# Altium schematic sheet MODULIQ_CFD.SchDoc: 4ch CFD
size A3; Author: M.Beldyga; CompanyName: WUT ISE; DrawnBy: M.Beldyga; Organization: WUT ISE; Address1: PW ISE; Address2: Nowowiejska 15/19 00-665 Warsaw; Address3: micbeldyga@gmail.com; SheetNumber: 1; SheetTotal: 3; ModifiedBy: -; CheckedDate: -; Title2: MODULIQ; DivGrp: WUT ISE; Designer: M.Beldyga; ModifiedDate: -; ProjectName: Sensor Box
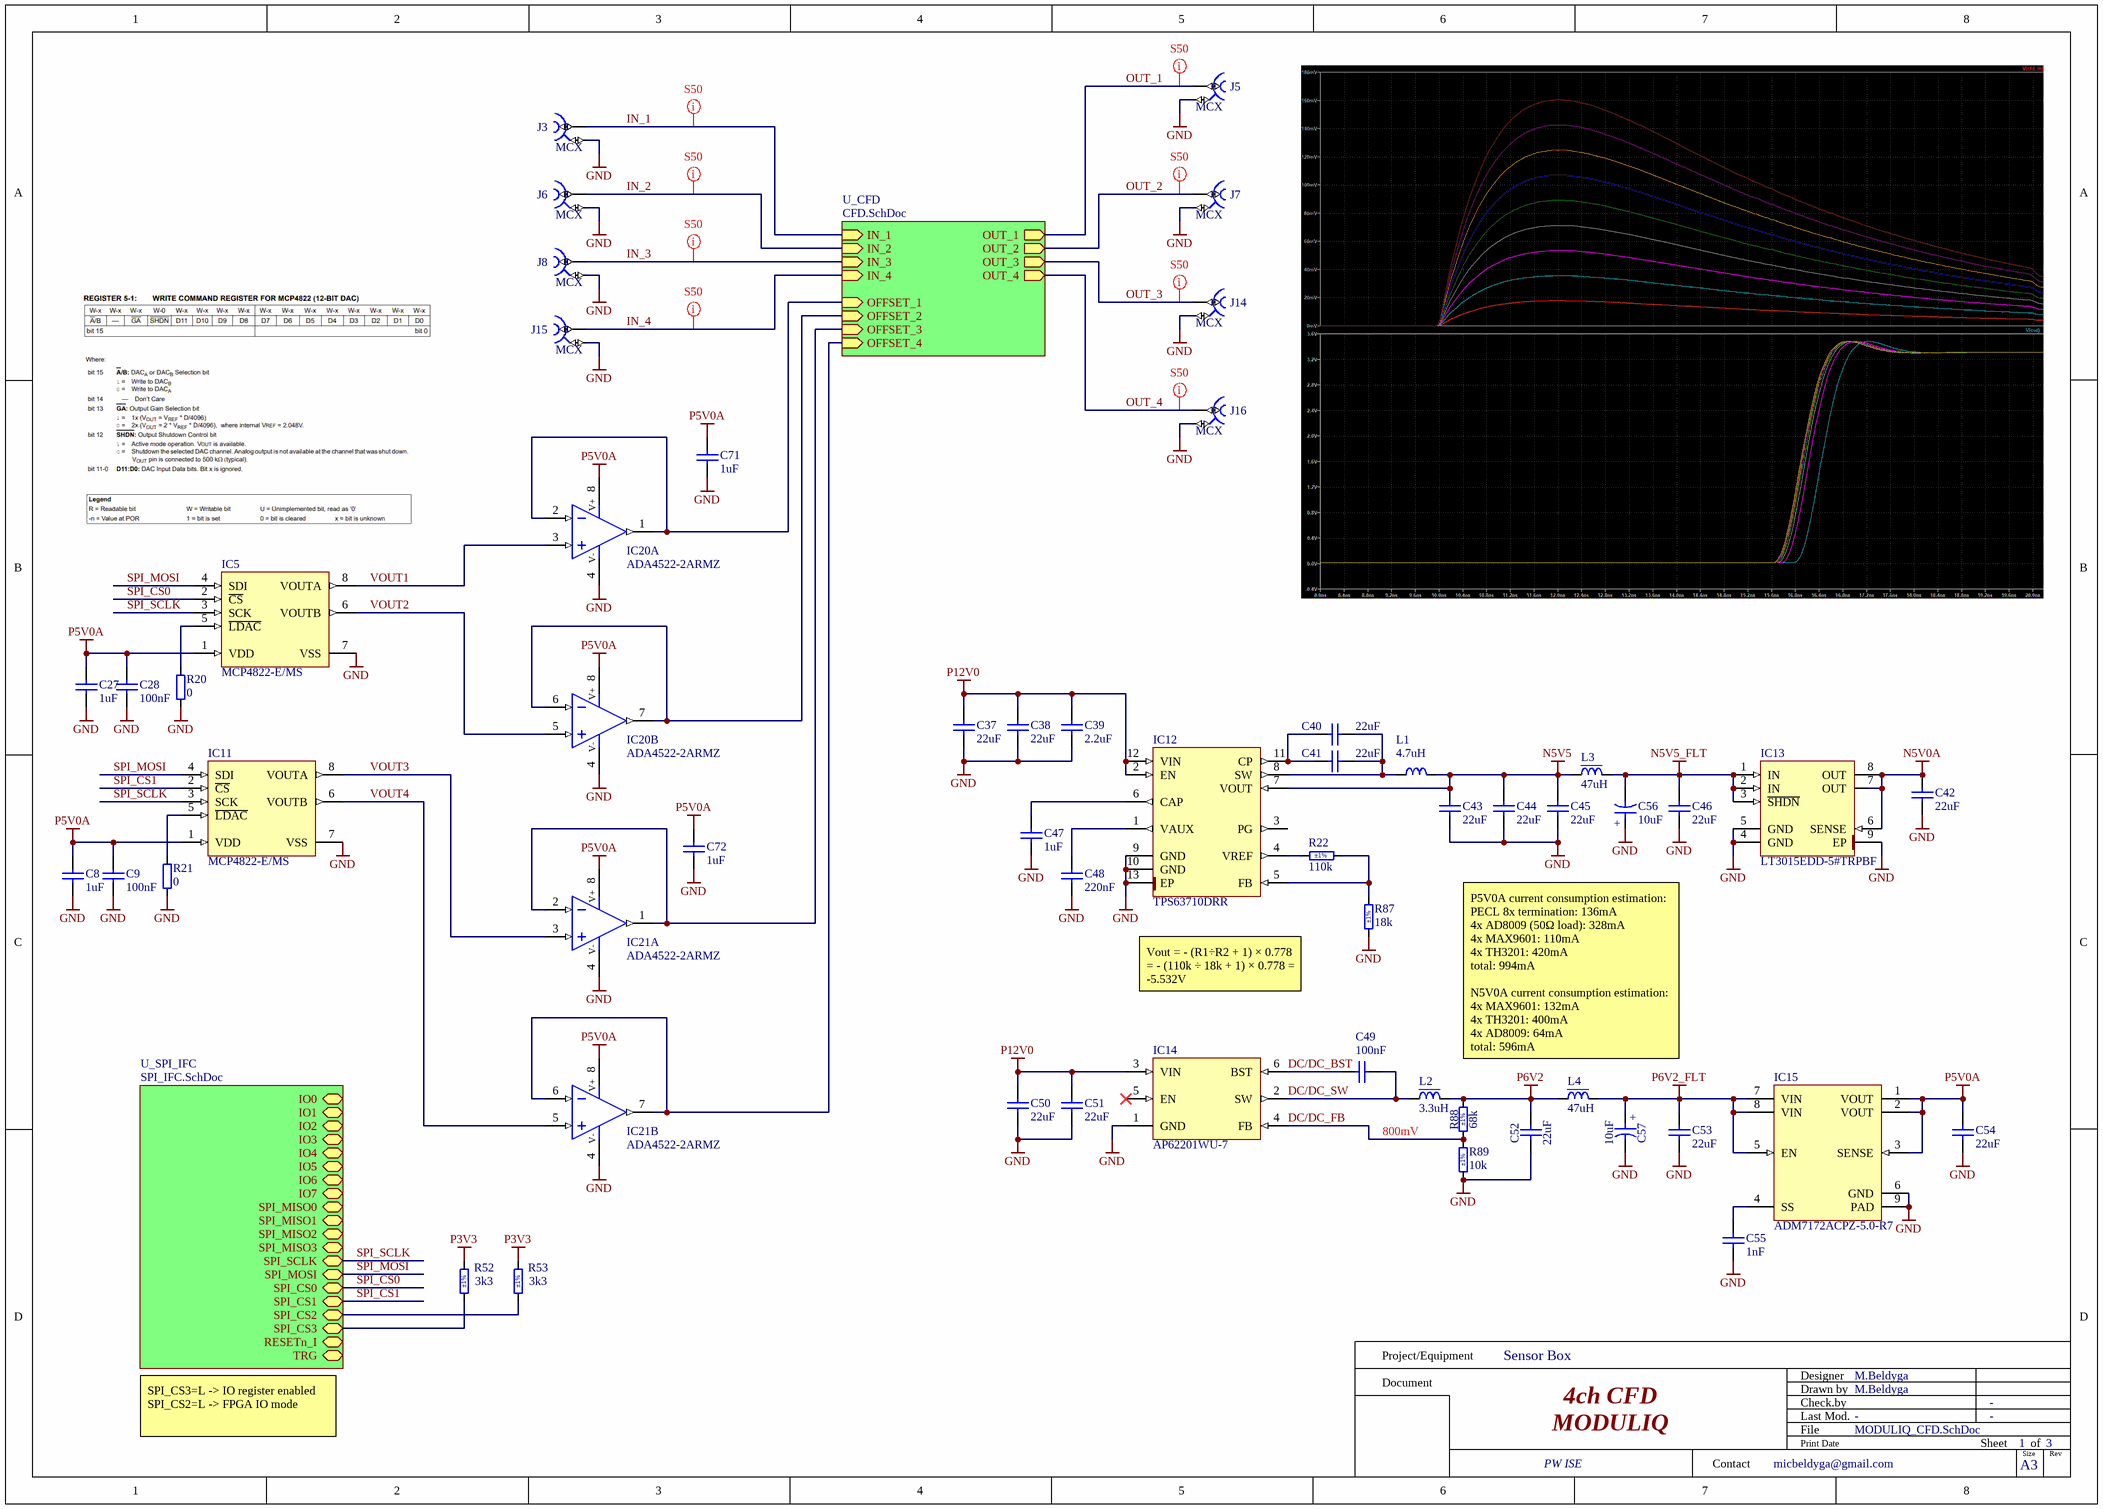
[diagram p0: MODULIQ_CFD.SchDoc]

## Parts
C8  1uF  [CAPC1005X55N]
C9  100nF  [CAPC1005X55N]
C27  1uF  [CAPC1005X55N]
C28  100nF  [CAPC1005X55N]
C37  22uF  [CAPC2012X135N]
C38  22uF  [CAPC2012X135N]
C39  2.2uF  [CAPC1005X55N]
C40  22uF  [CAPC2012X135N]
C41  22uF  [CAPC2012X135N]
C42  22uF  [CAPC2012X135N]
C43  22uF  [CAPC2012X135N]
C44  22uF  [CAPC2012X135N]
C45  22uF  [CAPC2012X135N]
C46  22uF  [CAPC2012X135N]
C47  1uF  [CAPC1005X55N]
C48  220nF  [CAPC1005X55N]
C49  100nF  [CAPC1005X55N]
C50  22uF  [CAPC2012X135N]
C51  22uF  [CAPC2012X135N]
C52  22uF  [CAPC2012X135N]
C53  22uF  [CAPC2012X135N]
C54  22uF  [CAPC2012X135N]
C55  1nF  [CAPC1005X55N]
C56  10uF  [CAPMP3216X180N]
C57  10uF  [CAPMP3216X180N]
C71  1uF  [CAPC1005X55N]
C72  1uF  [CAPC1005X55N]
IC5  MCP4822-E/MS  [SOP65P490X110-8N]
IC11  MCP4822-E/MS  [SOP65P490X110-8N]
IC12  TPS63710DRR  [SON50P300X300X80-13N-R160X260]
IC13  LT3015EDD-5#TRPBF  [SON50P300X300X80-9N-R175X248]
IC14  AP62201WU-7  [SOT95P280X100-6N]
IC15  ADM7172ACPZ-5.0-R7  [SON50P300X80_HS-9N]
IC20  ADA4522-2ARMZ  [SOP65P490X110-8N]  (parts A,B of 2)
IC21  ADA4522-2ARMZ  [SOP65P490X110-8N]  (parts A,B of 2)
J3  MCX  [AMPHENOL_919-109J-51PX]
J5  MCX  [AMPHENOL_919-109J-51PX]
J6  MCX  [AMPHENOL_919-109J-51PX]
J7  MCX  [AMPHENOL_919-109J-51PX]
J8  MCX  [AMPHENOL_919-109J-51PX]
J14  MCX  [AMPHENOL_919-109J-51PX]
J15  MCX  [AMPHENOL_919-109J-51PX]
J16  MCX  [AMPHENOL_919-109J-51PX]
L1  4.7uH  [IND_COILCRAFT_EPL3015]
L2  3.3uH  [IND_COILCRAFT_SD43]
L3  47uH  [IND_WURTH_WE-LHMI_7050]
L4  47uH  [IND_WURTH_WE-LHMI_7050]
R20  0  [RESC1005X40N]
R21  0  [RESC1005X40N]
R22  110k  Tolerance: ±1%  [RESC1005X40N]
R52  3k3  Tolerance: ±1%  [RESC1005X40N]
R53  3k3  Tolerance: ±1%  [RESC1005X40N]
R87  18k  Tolerance: ±1%  [RESC1005X40N]
R88  68k  Tolerance: ±1%  [RESC1005X40N]
R89  10k  Tolerance: ±1%  [RESC1005X40N]

## Sub-sheets
U_CFD = CFD.SchDoc: OFFSET_1 (in), IN_1 (in), OUT_1 (out), IN_2 (in), IN_3 (in), IN_4 (in), OFFSET_2 (in), OFFSET_3 (in), OFFSET_4 (in), OUT_2 (out), OUT_3 (out), OUT_4 (out)
U_SPI_IFC = SPI_IFC.SchDoc: IO0 (bidir), IO1 (bidir), IO2 (bidir), IO3 (bidir), IO4 (bidir), IO5 (bidir), IO6 (bidir), IO7 (bidir), SPI_MISO0 (bidir), SPI_MISO1 (bidir), SPI_MISO2 (bidir), SPI_MISO3 (bidir), SPI_SCLK (bidir), SPI_MOSI (bidir), SPI_CS0 (bidir), SPI_CS1 (bidir), SPI_CS2 (bidir), SPI_CS3 (bidir), RESETn_I (bidir), TRG (bidir)

## Nets
GND: C8.1 C9.1 C27.1 C28.1 C37.1 C38.1 C39.1 C42.1 C43.1 C44.1 C45.1 C46.1 C47.1 C48.1 C50.1 C51.1 C52.1 C53.1 C54.1 C55.1 C56.1 C57.2 C71.1 C72.1 IC5.7(VSS) IC11.7(VSS) IC12.9(GND) IC12.10(GND) IC12.13(EP) IC13.4(GND) IC13.5(GND) IC13.9(EP) IC14.1(GND) IC15.6(GND) IC15.9(PAD) IC20.4(V-) IC21.4(V-) J3.2 J5.2 J6.2 J7.2 J8.2 J14.2 J15.2 J16.2 R20.1 R21.1 R87.1 R89.1
N5V0A: C42.2 IC13.6(SENSE) IC13.7(OUT) IC13.8(OUT)
N5V5: C43.2 C44.2 C45.2 IC12.7(VOUT) L1.2 L3.1
N5V5_FLT: C46.2 C56.2 IC13.1(IN) IC13.2(IN) IC13.3(~{SHDN}) L3.2
P3V3: R52.1 R53.1
P5V0A: C8.2 C9.2 C27.2 C28.2 C54.2 C71.2 C72.2 IC5.1(VDD) IC11.1(VDD) IC15.1(VOUT) IC15.2(VOUT) IC15.3(SENSE) IC20.8(V+) IC21.8(V+)
P6V2: C52.2 L2.2 L4.1 R88.2
P6V2_FLT: C53.2 C57.1 IC15.5(EN) IC15.7(VIN) IC15.8(VIN) L4.2
P12V0: C37.2 C38.2 C39.2 C50.2 C51.2 IC12.2(EN) IC12.12(VIN) IC14.3(VIN)
DC/DC_BST: C49.1 IC14.6(BST)
DC/DC_FB: IC14.4(FB) R88.1 R89.2
DC/DC_SW: C49.2 IC14.2(SW) L2.1
IN_1: J3.1 ; sheet U_CFD/IN_1
IN_2: J6.1 ; sheet U_CFD/IN_2
IN_3: J8.1 ; sheet U_CFD/IN_3
IN_4: J15.1 ; sheet U_CFD/IN_4
OUT_1: J5.1 ; sheet U_CFD/OUT_1
OUT_2: J7.1 ; sheet U_CFD/OUT_2
OUT_3: J14.1 ; sheet U_CFD/OUT_3
OUT_4: J16.1 ; sheet U_CFD/OUT_4
SPI_CS0: IC5.2(~{CS}) ; sheet U_SPI_IFC/SPI_CS0
SPI_CS1: IC11.2(~{CS}) ; sheet U_SPI_IFC/SPI_CS1
SPI_MOSI: IC5.4(SDI) IC11.4(SDI) ; sheet U_SPI_IFC/SPI_MOSI
SPI_SCLK: IC5.3(SCK) IC11.3(SCK) ; sheet U_SPI_IFC/SPI_SCLK
VOUT1: IC5.8(VOUTA) IC20.3(IN+)
VOUT2: IC5.6(VOUTB) IC20.5(IN+)
VOUT3: IC11.8(VOUTA) IC21.3(IN+)
VOUT4: IC11.6(VOUTB) IC21.5(IN+)
NetC40_1: C40.1 C41.1 IC12.8(SW) L1.1
NetC40_2: C40.2 C41.2 IC12.11(CP)
NetC47_2: C47.2 IC12.6(CAP)
NetC48_2: C48.2 IC12.1(VAUX)
NetC55_2: C55.2 IC15.4(SS)
NetIC5_5: IC5.5(~{LDAC}) R20.2
NetIC11_5: IC11.5(~{LDAC}) R21.2
NetIC12_4: IC12.4(VREF) R22.1
NetIC12_5: IC12.5(FB) R22.2 R87.2
NetIC20_1: IC20.1(OUT) IC20.2(IN-) ; sheet U_CFD/OFFSET_1
NetIC20_6: IC20.6(IN-) IC20.7(OUT) ; sheet U_CFD/OFFSET_2
NetIC21_1: IC21.1(OUT) IC21.2(IN-) ; sheet U_CFD/OFFSET_3
NetIC21_6: IC21.6(IN-) IC21.7(OUT) ; sheet U_CFD/OFFSET_4
NetR52_2: R52.2 ; sheet U_SPI_IFC/SPI_CS3
NetR53_2: R53.2 ; sheet U_SPI_IFC/SPI_CS2

Not connected (* = marked no-connect by the designer): IC12 3(PG); IC14 5(EN)*

## Layout directives
net class S50: IN_1, IN_2, IN_3, IN_4, OUT_1, OUT_2, OUT_3, OUT_4

## Notes on the sheet
- Vout = - (R1÷R2 + 1) × 0.778 = - (110k ÷ 18k + 1) × 0.778 = -5.532V
- P5V0A current consumption estimation:
  PECL 8x termination: 136mA
  4x AD8009 (50Ω load): 328mA
  4x MAX9601: 110mA
  4x TH3201: 420mA
  total: 994mA
  N5V0A current consumption estimation:
  4x MAX9601: 132mA
  4x TH3201: 400mA
  4x AD8009: 64mA
  total: 596mA
- (near L2) 800mV
- SPI_CS3=L -> IO register enabled
  SPI_CS2=L -> FPGA IO mode
- Project/Equipment
- Document
- Designer
- Drawn by
- Check.by
- Contact
- File
- Last Mod.
- Print Date
- Sheet
- Size
- A3
- of
- Rev
- (in symbol CTE3216-18_10UF_16V_20%_AVX_TCJ) +

## Library data of the parts
C8 C27 C47 C71 C72 = CC0402_1UF_16V_10%_X5R: Non-polarised capacitor; Part Description: SMD Multilayer Chip Ceramic Capacitor; Manufacturer: GENERIC; Manufacturer1 Part Number: C1005X5R1C105KT; Voltage: 16V; TC: X5R; Tolerance: ±10%; Part Number: CC0402_1UF_16V_10%_X5R; Component Kind: Standard; Component Type: Standard; Pin Count: 2; Value: 1uF; Status: Preferred; Manufacturer Part Number: CC0402_1UF_16V_10%_X5R; Case: 0402; Mounted: Yes; Socket: No; SMD: Yes; Sense: No; Manufacturer1 Example: TDK; Manufacturer1 ComponentHeight: 0.55mm; HelpURL: \\cern.ch\dfs\Applications\Altium\Datasheets\CC0402_X5R_TDK_C.pdf; Author: CERN DEM JLC; CreateDate: 10/25/2012; LatestRevisionDate: 10/25/2012
C9 C28 = CC0402_100NF_50V_10%_X7R: Non-polarised capacitor; Part Description: SMD Multilayer Chip Ceramic Capacitor; Manufacturer: GENERIC; Manufacturer1 Part Number: GRM155R71H104KE14D; Voltage: 50V; TC: X7R; Tolerance: ±10%; Part Number: CC0402_100NF_50V_10%_X7R; Component Kind: Standard; Component Type: Standard; Pin Count: 2; Value: 100nF; Status: None; Manufacturer Part Number: CC0402_100NF_50V_10%_X7R; Case: 0402; Mounted: Yes; Socket: No; SMD: Yes; Sense: No; Manufacturer1 Example: MURATA; Manufacturer1 ComponentHeight: 0.55mm; HelpURL: \\cern.ch\dfs\Applications\Altium\Datasheets\CC0402_MURATA_GRM155R71H104KE14D.pdf; Author: CERN DEM MR; CreateDate: 6/30/2017; LatestRevisionDate: 6/30/2017
C37 C38 C40-C46 C50-C54 = CC0805_22UF_16V_10%_X5R: Non-polarised capacitor; Part Description: SMD Multilayer Chip Ceramic Capacitor; Manufacturer: GENERIC; Manufacturer1 Part Number: C2012X5R1C226KT; Voltage: 16V; TC: X5R; Tolerance: ±10%; Part Number: CC0805_22UF_16V_10%_X5R; Component Kind: Standard; Component Type: Standard; Pin Count: 2; Value: 22uF; Status: Preferred; Manufacturer Part Number: CC0805_22UF_16V_10%_X5R; Case: 0805; Mounted: Yes; Socket: No; SMD: Yes; Sense: No; Manufacturer1 Example: TDK; Manufacturer1 ComponentHeight: 1.35mm; HelpURL: \\cern.ch\dfs\Applications\Altium\Datasheets\CC0805_X5R_TDK_C.pdf; Author: CERN DEM JLC
  C37 C38 C40-C46 C50 C51 C53 C54: CreateDate: 10/25/2012; LatestRevisionDate: 10/25/2012
  C52: CreateDate: 25.10.2012; LatestRevisionDate: 25.10.2012
C39 = CC0402_2.2UF_25V_10%_X5R: Non-polarised capacitor; Part Description: SMD Multilayer Chip Ceramic Capacitor; Manufacturer: GENERIC; Manufacturer1 Part Number: C1005X5R1E225K050; Voltage: 25V; TC: X5R; Tolerance: ±10%; Part Number: CC0402_2.2UF_25V_10%_X5R; Component Kind: Standard; Component Type: Standard; Pin Count: 2; Value: 2.2uF; Status: None; Manufacturer Part Number: CC0402_2.2UF_25V_10%_X5R; Case: 0402; Mounted: Yes; Socket: No; SMD: Yes; Sense: No; Manufacturer1 Example: TDK; Manufacturer1 ComponentHeight: 0.65mm; HelpURL: \\cern.ch\dfs\Applications\Altium\Datasheets\CC0402_X5R_TDK_C.pdf; Author: CERN DEM BC; CreateDate: 1/10/2020; LatestRevisionDate: 1/10/2020
C48 = CC0402_220NF_25V_10%_X7R: Non-polarised capacitor; Part Description: SMD Multilayer Chip Ceramic Capacitor; Manufacturer: GENERIC; Manufacturer1 Part Number: C1005X7R1E224K050; Voltage: 25V; TC: X7R; Tolerance: ±10%; Part Number: CC0402_220NF_25V_10%_X7R; Component Kind: Standard; Component Type: Standard; Pin Count: 2; Value: 220nF; Status: Preferred; Manufacturer Part Number: CC0402_220NF_25V_10%_X7R; Case: 0402; Mounted: Yes; Socket: No; SMD: Yes; Sense: No; Manufacturer1 Example: TDK; Manufacturer1 ComponentHeight: 0.55mm; HelpURL: \\cern.ch\dfs\Applications\Altium\Datasheets\CC0402_X7R_TDK_C.pdf; Author: CERN DEM BC; CreateDate: 10/19/2020; LatestRevisionDate: 10/19/2020
C49 = CC0402_100NF_16V_10%_X7R: Non-polarised capacitor; Part Description: SMD Multilayer Chip Ceramic Capacitor; Manufacturer: GENERIC; Manufacturer1 Part Number: GRM155R71C104KA88D; Voltage: 16V; TC: X7R; Tolerance: ±10%; Part Number: CC0402_100NF_16V_10%_X7R; Component Kind: Standard; Component Type: Standard; Pin Count: 2; Value: 100nF; Status: Not Recommended; Manufacturer Part Number: CC0402_100NF_16V_10%_X7R; Case: 0402; Mounted: Yes; Socket: No; SMD: Yes; Sense: No; Manufacturer1 Example: MURATA; Manufacturer1 ComponentHeight: 0.55mm; HelpURL: \\cern.ch\dfs\Applications\Altium\Datasheets\CC0402_X7R_MURATA_GRM.pdf; Author: CERN DEM JLC; CreateDate: 12/5/2013; LatestRevisionDate: 12/3/2007
C55 = CC0402_1NF_50V_10%_X7R: Non-polarised capacitor; Part Description: SMD Multilayer Chip Ceramic Capacitor; Manufacturer: GENERIC; Manufacturer1 Part Number: 223858715623; Voltage: 50V; TC: X7R; Tolerance: ±10%; Part Number: CC0402_1NF_50V_10%_X7R; Component Kind: Standard; Component Type: Standard; Pin Count: 2; Value: 1nF; Status: Not Recommended; Manufacturer Part Number: CC0402_1NF_50V_10%_X7R; Case: 0402; Mounted: Yes; Socket: No; SMD: Yes; Sense: No; Manufacturer1 Example: PHYCOMP; Manufacturer1 ComponentHeight: 0.55mm; HelpURL: \\cern.ch\dfs\Applications\Altium\Datasheets\CC0402_X7R_PHYCOMP.pdf; Author: CERN DEM JLC; CreateDate: 12/3/2007; LatestRevisionDate: 12/3/2007
C56 C57 = CTE3216-18_10UF_16V_20%_AVX_TCJ: Polarised capacitor; Part Description: ESR 0R200 Tantalum Solid Electrolytic Chip Capacitor with Conductive Polymer Electrode; Manufacturer: AVX; Manufacturer Part Number: TCJA106M016R0200; Voltage: 16V; Tolerance: ±20%; Part Number: CTE3216-18_10UF_16V_20%_AVX_TCJ; Component Kind: Standard; Component Type: Standard; Pin Count: 2; Value: 10uF; Status: Preferred; Case: A; Mounted: Yes; Socket: No; SMD: Yes; Sense: No; ComponentHeight: 1.8mm; HelpURL: \\cern.ch\dfs\Applications\Altium\Datasheets\CTE_AVX_TCJ.pdf; Author: CERN DEM JLC; CreateDate: 29.03.2012; LatestRevisionDate: 29.03.2012
IC5 IC11 = MCP4822-E/MS: 12-Bit Dual Voltage Output Digital-to-Analog Converter with Internal VREF and SPI Interface; Manufacturer: MICROCHIP TECHNOLOGY; PressFit: No; Bonding: No; Part Number: MCP4822-E/MS; Component Kind: Standard; Component Type: Standard; Device: MCP4822-E/MS; PackageDescription: SOP, 0.65mm Pitch; 8 Pin, 3.00mm W X 3.00mm L X 1.10mm H body, IPC Medium Density; Part Description: 12-Bit Dual Voltage Output Digital-to-Analog Converter with Internal VREF and SPI Interface; Manufacturer Part Number: MCP4822-E/MS; Pin Count: 8; Case: MSOP8; Mounted: Yes; Socket: No; SMD: Yes; Sense: No; ComponentHeight: 1.1mm; Author: CERN DEM MR; HelpURL: \\cern.ch\dfs\Applications\Altium\Datasheets\MCP4822-E-MS.pdf; CreateDate: 3/16/2016; LatestRevisionDate: 3/16/2016
IC12 = TPS63710DRR: -1 to -5.5VDC, 1A Output, Low Noise Synchronous Inverting Buck Converter; Manufacturer: TEXAS INSTRUMENTS; PressFit: No; Bonding: No; Part Number: TPS63710DRR; Component Kind: Standard; Component Type: Standard; Device: TPS63710DRR; PackageDescription: SON, 0.50mm Pitch; 12 Pin, 3.00mm W X 3.00mm L X 0.80mm H body (w/Thermal Tab 1.60 X 2.60mm), IPC Medium Density; Part Description: -1 to -5.5VDC, 1A Output, Low Noise Synchronous Inverting Buck Converter; Manufacturer Part Number: TPS63710DRR; Pin Count: 13; Case: SON12; Mounted: Yes; Socket: No; SMD: Yes; Sense: No; ComponentHeight: 0.8mm; HelpURL: \\cern.ch\dfs\Applications\Altium\Datasheets\TPS63710DRR.pdf; Author: CERN DEM BC; CreateDate: 2/11/2019; LatestRevisionDate: 2/11/2019
IC13 = LT3015EDD-5#TRPBF: SP-LINREG -5V 1.5A, Low Noise, Negative Linear Regulator with Precision Current Limit; Manufacturer: Analog Devices; Manufacturer Lifecycle Status: PRODUCTION; Dropout Voltage: 310mV; Max Supply Voltage: -1.8V; Min Current Limit: 1.7A; Min Input Voltage: -30V; Number of Outputs: 1; Operating Supply Current: 1.1mA; Power Supply Rejection Ratio (PSRR): 58dB; Supplier: DigiKey; Supplier Part Number: LT3015EDD-5#TRPBFCT-ND; Manufacturer Part Number: LT3015EDD-5#TRPBF; RoHS: Compliant; Category: Voltage Regulators - Linear; Stock: 583; Pricing: 1=9.06, 10=6.116, 25=5.348, 100=4.4793, 250=4.05276, 500=4.0125 (USD); Case/Package: DFN; Lifecycle Status: Production; Max Operating Temperature: 125°C; Min Operating Temperature: -40°C; Pins: 8; Number of Regulators: 1; Output Current: 1.5A; Output Voltage: -5V; Packaging: Tape and Reel; ComponentLink1URL: https://datasheet.octopart.com:443/LT3015EDD-5%23TRPBF-Linear-Technology-datasheet-17020859.pdf?src-supplier=Upverter; ComponentLink1Description: https://datasheet.octopart.com:443/LT3015EDD-5%23TRPBF-Linear-Technology-datasheet-17020859.pdf?src-supplier=Upverter; ComponentLink2URL: https://datasheet.octopart.com:443/LT3015EDD-5%23TRPBF-Analog-Devices-datasheet-158590489.pdf?src-supplier=Augswan; ComponentLink2Description: https://datasheet.octopart.com:443/LT3015EDD-5%23TRPBF-Analog-Devices-datasheet-158590489.pdf?src-supplier=Augswan; ComponentLink3URL: https://datasheet.octopart.com:443/LT3015EDD-5%23TRPBF-Linear-Technology-datasheet-11545014.pdf?src-supplier=Arrow+Electronics; ComponentLink3Description: https://datasheet.octopart.com:443/LT3015EDD-5%23TRPBF-Linear-Technology-datasheet-11545014.pdf?src-supplier=Arrow+Electronics; ComponentLink4URL: https://datasheet.octopart.com:443/LT3015EDD-5%23TRPBF-Linear-Technology-datasheet-10541950.pdf?src-supplier=Component+Distributors+Inc.; ComponentLink4Description: https://datasheet.octopart.com:443/LT3015EDD-5%23TRPBF-Linear-Technology-datasheet-10541950.pdf?src-supplier=Component+Distributors+Inc.; ComponentLink5URL: https://sigma.octopart.com:443/57689710/technical_drawing/Linear-Technology-LT3015EDD-5%23TRPBF.pdf?src-supplier=Linear+Technology; ComponentLink5Description: https://sigma.octopart.com:443/57689710/technical_drawing/Linear-Technology-LT3015EDD-5%23TRPBF.pdf?src-supplier=Linear+Technology; ComponentLink6URL: http://sigma.octopart.com:80/conflict_mineral_statement/Analog-Devices-company-33.pdf?src-supplier=Compliance+Statements; ComponentLink6Description: http://sigma.octopart.com:80/conflict_mineral_statement/Analog-Devices-company-33.pdf?src-supplier=Compliance+Statements
IC14 = AP62201WU-7: 4.2V TO 18V INPUT, 2A LOW IQ SYNCHRONOUS BUCK CONVERTER; Manufacturer: DIODES INCORPORATED; PressFit: No; Bonding: No; Part Number: AP62201WU-7; Component Kind: Standard; Component Type: Standard; Device: AP62201WU-7; PackageDescription: SOT23, 0.95mm Pitch; 6 Pin, 1.625mm W X 2.90mm L X 1.00mm H body, IPC Medium Density; Part Description: 4.2V To 18V Input, 2A Low Iq Synchronous Buck Converter; Manufacturer Part Number: AP62201WU; Pin Count: 6; Case: SOT23-6; Mounted: Yes; Socket: No; SMD: Yes; Sense: No; ComponentHeight: 1.1mm; HelpURL: \\cern.ch\dfs\Applications\Altium\Datasheets\AP6220x.pdf; Author: CERN DEM HF; CreateDate: 1/7/2022; LatestRevisionDate: 3/21/2022
IC15 = ADM7172ACPZ-5.0-R7: LDO Regulator Pos 5V 2A Medical 8-Pin LFCSP EP T/R; Manufacturer: Analog Devices; Manufacturer Lifecycle Status: PRODUCTION; Accuracy: 1.5%; Dropout Voltage: 172mV; Max Supply Voltage: 6.5V; Max Junction Temperature (Tj): 125°C; Min Current Limit: 2.4A; Min Input Voltage: 2.3V; Number of Outputs: 1; Output Type: Fixed; Polarity: Positive; Quiescent Current: 2mA; Supplier: DigiKey; Supplier Part Number: 505-ADM7172ACPZ-5.0-R7CT-ND; Manufacturer Part Number: ADM7172ACPZ-5.0-R7; RoHS: Compliant; Category: Voltage Regulators - Linear; Stock: 6271; Pricing: 1=7.36, 10=4.904, 25=4.2636, 100=3.5395, 250=3.184, 500=3.025 (USD); Height: 800µm; Lead Free: Contains Lead; Lifecycle Status: Production; Max Operating Temperature: 125°C; Max Output current: 2A; Min Operating Temperature: -40°C; Min Supply Voltage: 2.3V; Mounting Technology: Surface Mount; Pins: 8; Number of Regulators: 1; Output Current: 2A; Output Voltage: 5V; Schedule B: 8542390000, 8542390000|8542390000|8542390000|8542390000|8542390000|8542390000|8542390000|8542390000|8542390000|8542390000|8542390000|8542390000|8542390000|8542390000|8542390000|8542390000|8542390000|8542390000|8542390000|8542390000|8542390000|8542390000|8542390000|85; ComponentLink1URL: https://octopart.com:443/opatz8j6/c1?t=-kg1fruxyCulxAB36_ohkSeev8zgFJlSztYYywdJOch0YJASdKLJyLL0mnslGa-t6PsagxMYHR8aBcHPaVgh4IUQDZt-3WXwMyuqURzA76Vtfm21gPS0gAP76VpFIBnSFcC2xO7Njhso9vOMd6kPX9ZtpPx_JEH0rjrCDRSPTXoVDm5SGiKV2xp3K9mOzSmkpo4HIDIDOC18jz3kKRvDBXpR3TfUVKEnwaVAsqJmE7RLpE7-d1-GaLHbsRGPp2W6BvKxBkrE_yPtGFhUpLThps_d4S-1a0OBIPC-Xc6uJtdFGXXVn2I5jjc&src-supplier=Analog+Devices; ComponentLink1Description: https://octopart.com:443/opatz8j6/c1?t=-kg1fruxyCulxAB36_ohkSeev8zgFJlSztYYywdJOch0YJASdKLJyLL0mnslGa-t6PsagxMYHR8aBcHPaVgh4IUQDZt-3WXwMyuqURzA76Vtfm21gPS0gAP76VpFIBnSFcC2xO7Njhso9vOMd6kPX9ZtpPx_JEH0rjrCDRSPTXoVDm5SGiKV2xp3K9mOzSmkpo4HIDIDOC18jz3kKRvDBXpR3TfUVKEnwaVAsqJmE7RLpE7-d1-GaLHbsRGPp2W6BvKxBkrE_yPtGFhUpLThps_d4S-1a0OBIPC-Xc6uJtdFGXXVn2I5jjc&src-supplier=Analog+Devices; ComponentLink2URL: https://datasheet.octopart.com:443/ADM7172ACPZ-5.0-R7-Analog-Devices-datasheet-48279025.pdf?src-supplier=Analog+Devices; ComponentLink2Description: https://datasheet.octopart.com:443/ADM7172ACPZ-5.0-R7-Analog-Devices-datasheet-48279025.pdf?src-supplier=Analog+Devices; ComponentLink3URL: https://datasheet.octopart.com:443/ADM7172ACPZ-5.0-R7-Analog-Devices-datasheet-38520329.pdf?src-supplier=Analog+Devices; ComponentLink3Description: https://datasheet.octopart.com:443/ADM7172ACPZ-5.0-R7-Analog-Devices-datasheet-38520329.pdf?src-supplier=Analog+Devices; ComponentLink4URL: https://datasheet.octopart.com:443/ADM7172ACPZ-5.0-R7-Analog-Devices-datasheet-28823778.pdf?src-supplier=Analog+Devices; ComponentLink4Description: https://datasheet.octopart.com:443/ADM7172ACPZ-5.0-R7-Analog-Devices-datasheet-28823778.pdf?src-supplier=Analog+Devices; ComponentLink5URL: https://datasheet.octopart.com:443/ADM7172ACPZ-5.0-R7-Analog-Devices-datasheet-138896285.pdf?src-supplier=element14+APAC; ComponentLink5Description: https://datasheet.octopart.com:443/ADM7172ACPZ-5.0-R7-Analog-Devices-datasheet-138896285.pdf?src-supplier=element14+APAC; ComponentLink6URL: https://datasheet.octopart.com:443/ADM7172ACPZ-5.0-R7-Analog-Devices-datasheet-65849620.pdf?src-supplier=Farnell; ComponentLink6Description: https://datasheet.octopart.com:443/ADM7172ACPZ-5.0-R7-Analog-Devices-datasheet-65849620.pdf?src-supplier=Farnell; ComponentLink7URL: https://datasheet.octopart.com:443/ADM7172ACPZ-5.0-R7-Analog-Devices-datasheet-85391316.pdf?src-supplier=Augswan; ComponentLink7Description: https://datasheet.octopart.com:443/ADM7172ACPZ-5.0-R7-Analog-Devices-datasheet-85391316.pdf?src-supplier=Augswan; ComponentLink8URL: http://sigma.octopart.com:80/conflict_mineral_statement/Analog-Devices-company-33.pdf?src-supplier=Compliance+Statements; ComponentLink8Description: http://sigma.octopart.com:80/conflict_mineral_statement/Analog-Devices-company-33.pdf?src-supplier=Compliance+Statements; ComponentLink9URL: https://octopart.com:443/opatz8j6/c1?t=TmvOjRv4PThcL7dm5wMW_d1BBZBtqEhjWJvr4N_XlKCw10yg4VuLRDd1HtoGFtAYuFE1BImDIpWX5IxsXKGpmnF1sjJqQHOPK0r_3t9248Z6xiTWrb224xTd9myI0w0fwxxguJs9dZCGn21U8Urge7ieIxNVbyaHZTAm727Fnbzgkl2AcUW9WdILu_ooBOrFgeqeaTtjDTzoJhR8djPIaGiCyfFUY7-QT4uW4vfMcim6ys_276BORD2TsyDJFFkCNdu5WMvBM2k_y78hsHjt0ZaqWQK693KCzyc2OOmCA0V5SrHfAd3gH7I&src-supplier=Compliance+Statements; ComponentLink9Description: https://octopart.com:443/opatz8j6/c1?t=TmvOjRv4PThcL7dm5wMW_d1BBZBtqEhjWJvr4N_XlKCw10yg4VuLRDd1HtoGFtAYuFE1BImDIpWX5IxsXKGpmnF1sjJqQHOPK0r_3t9248Z6xiTWrb224xTd9myI0w0fwxxguJs9dZCGn21U8Urge7ieIxNVbyaHZTAm727Fnbzgkl2AcUW9WdILu_ooBOrFgeqeaTtjDTzoJhR8djPIaGiCyfFUY7-QT4uW4vfMcim6ys_276BORD2TsyDJFFkCNdu5WMvBM2k_y78hsHjt0ZaqWQK693KCzyc2OOmCA0V5SrHfAd3gH7I&src-supplier=Compliance+Statements
IC20 IC21 = ADA4522-2ARMZ: Dual Operational Amplifier; Part Description: 55V, EMI Enhanced, Zero Drift, Ultralow Noise, Dual Rail-to-Rail Output Operational Amplifier; Manufacturer: ANALOG DEVICES; PressFit: No; Bonding: No; Part Number: ADA4522-2ARMZ; Component Kind: Standard; Component Type: Standard; Device: ADA4522-2ARMZ; PackageDescription: SOP, 0.65mm Pitch; 8 Pin, 3.00mm W X 3.00mm L X 1.10mm H body, IPC Medium Density; Manufacturer Part Number: ADA4522-2ARM; Pin Count: 8; Case: MSOP8; Mounted: Yes; Socket: No; SMD: Yes; Sense: No; ComponentHeight: 1.1mm; Author: CERN DEM BC; HelpURL: \\cern.ch\dfs\Applications\Altium\Datasheets\ADA4522-2ARMZ.pdf; CreateDate: 7/28/2017; LatestRevisionDate: 3/31/2022
J3 J5-J8 J14-J16 = AMPHENOL_919-109J-51PX: Part Description: 50 Ohms, RF Connector, MCX Straight PCB Receptacle Jack; Manufacturer Part Number: 919-109J-51PX (MCX6251B1-3GT30G-50); PressFit: No; Part Number: AMPHENOL_919-109J-51PX; Component Kind: Standard; Component Type: Standard; Pin Count: 5; Family: MCX; Mounted: Yes; Socket: No; SMD: No; Sense: No; Status: None; Manufacturer: AMPHENOL; ComponentHeight: 6.06mm; HelpURL: \\cern.ch\dfs\Applications\Altium\Datasheets\AMPHENOL_919-109J-51PX.pdf; Author: CERN DEM BC; CreateDate: 31.01.2019; LatestRevisionDate: 31.01.2019
L1 = IND_4.7UH_20%_COILCRAFT_EPL3015: Inductor; Part Description: Shielded SMD Power Inductor; Manufacturer Part Number: EPL3015-472ML; Power: 1A; Resistance: 0.145R; Tolerance: ±20%; Part Number: IND_4.7UH_20%_COILCRAFT_EPL3015; Component Kind: Standard; Component Type: Standard; Pin Count: 2; Value: 4.7uH; Manufacturer: COILCRAFT; Mounted: Yes; Socket: No; SMD: Yes; Sense: No; ComponentHeight: 1.55mm; HelpURL: \\cern.ch\dfs\Applications\Altium\Datasheets\IND_COILCRAFT_EPL3015.pdf; Author: CERN DEM BC; CreateDate: 2/27/2017; LatestRevisionDate: 2/27/2017
L2 = IND_3.3UH_20%_COILCRAFT_SD43-332MLB: Inductor With Core; Part Description: SMT Power Inductor (SD43 Series); Power: 2.1A; Resistance: 0.582R; Tolerance: ±20%; Part Number: IND_3.3UH_20%_COILCRAFT_SD43-332MLB; Component Kind: Standard; Component Type: Standard; Pin Count: 2; Value: 3.3uH; Manufacturer: COILCRAFT; Manufacturer Part Number: SD43-332MLB; Mounted: Yes; Socket: No; SMD: Yes; Sense: No; ComponentHeight: 3.45mm; HelpURL: \\cern.ch\dfs\Applications\Altium\Datasheets\IND_COILCRAFT_SD43.pdf; Author: CERN DEM JLC; CreateDate: 9/13/2018; LatestRevisionDate: 9/13/2018
L3 L4 = IND_47UH_20%_WURTH_WE-LHMI_74437349470: Inductor With Core; Part Description: SMD Power Inductor (WE-LHMI Series); Manufacturer: WURTH ELEKTRONIK; Power: 1.45A; Resistance: 0.290R; Tolerance: ±20%; Part Number: IND_47UH_20%_WURTH_WE-LHMI_74437349470; Component Kind: Standard; Component Type: Standard; Pin Count: 2; Value: 47uH; Manufacturer Part Number: 74437349470; Mounted: Yes; Socket: No; SMD: Yes; Sense: No; ComponentHeight: 5mm; HelpURL: \\cern.ch\dfs\Applications\Altium\Datasheets\IND_WURTH_WE-LHMI_74437349470.pdf; Author: CERN DEM HF; CreateDate: 11/22/2023; LatestRevisionDate: 11/22/2023
R20 R21 = R0402_0R_JUMPER: Resistor; Part Description: 1A (0.05R Max DC Resistance) Zero Ohm Jumper; Manufacturer: GENERIC; Manufacturer1 Part Number: 232270591001L; PressFit: No; Part Number: R0402_0R_JUMPER; Component Kind: Standard; Component Type: Standard; Pin Count: 2; Value: 0; Status: Not Recommended; Manufacturer Part Number: R0402_0R_JUMPER; Case: 0402; Mounted: Yes; Sense: No; Socket: No; SMD: Yes; Manufacturer1 Example: YAGEO PHYCOMP; Manufacturer1 ComponentHeight: 0.4mm; HelpURL: \\cern.ch\dfs\Applications\Altium\Datasheets\R0402_Phycomp_RC0402.pdf; Author: CERN DEM JLC; CreateDate: 12/3/2007; LatestRevisionDate: 10/17/2012
R22 = R0402_110K_1%_0.0625W_100PPM: Resistor - 1%; Part Description: General Purpose Thick Film Chip Resistor; Manufacturer: GENERIC; Manufacturer1 Part Number: 232270671104L; TC: ±100ppm/°C; PressFit: No; Part Number: R0402_110K_1%_0.0625W_100PPM; Component Kind: Standard; Component Type: Standard; Pin Count: 2; Value: 110k; Status: Not Recommended; Power: 0.0625W; Manufacturer Part Number: R0402_110K_1%_0.0625W_100PPM; Case: 0402; Mounted: Yes; Sense: No; Socket: No; SMD: Yes; Manufacturer1 Example: YAGEO PHYCOMP; Manufacturer1 ComponentHeight: 0.4mm; HelpURL: \\cern.ch\dfs\Applications\Altium\Datasheets\R0402_Phycomp_RC0402.pdf; Author: CERN DEM JLC; CreateDate: 12/3/2007; LatestRevisionDate: 10/17/2012
R52 R53 = R0402_3K3_1%_0.0625W_100PPM: Resistor - 1%; Part Description: General Purpose Thick Film Chip Resistor; Manufacturer: GENERIC; Manufacturer1 Part Number: 232270673302L; TC: ±100ppm/°C; PressFit: No; Part Number: R0402_3K3_1%_0.0625W_100PPM; Component Kind: Standard; Component Type: Standard; Pin Count: 2; Value: 3k3; Status: Not Recommended; Power: 0.0625W; Manufacturer Part Number: R0402_3K3_1%_0.0625W_100PPM; Case: 0402; Mounted: Yes; Sense: No; Socket: No; SMD: Yes; Manufacturer1 Example: YAGEO PHYCOMP; Manufacturer1 ComponentHeight: 0.4mm; HelpURL: \\cern.ch\dfs\Applications\Altium\Datasheets\R0402_Phycomp_RC0402.pdf; Author: CERN DEM JLC; CreateDate: 03.12.2007; LatestRevisionDate: 17.10.2012
R87 = R0402_18K_1%_0.0625W_100PPM: Resistor - 1%; Part Description: General Purpose Thick Film Chip Resistor; Manufacturer: GENERIC; Manufacturer1 Part Number: 232270671803L; TC: ±100ppm/°C; PressFit: No; Part Number: R0402_18K_1%_0.0625W_100PPM; Component Kind: Standard; Component Type: Standard; Pin Count: 2; Value: 18k; Status: Not Recommended; Power: 0.0625W; Manufacturer Part Number: R0402_18K_1%_0.0625W_100PPM; Case: 0402; Mounted: Yes; Sense: No; Socket: No; SMD: Yes; Manufacturer1 Example: YAGEO PHYCOMP; Manufacturer1 ComponentHeight: 0.4mm; HelpURL: \\cern.ch\dfs\Applications\Altium\Datasheets\R0402_Phycomp_RC0402.pdf; Author: CERN DEM JLC; CreateDate: 12/3/2007; LatestRevisionDate: 10/17/2012
R88 = R0402_68K_1%_0.0625W_100PPM: Resistor - 1%; Part Description: General Purpose Thick Film Chip Resistor; Manufacturer: GENERIC; Manufacturer1 Part Number: 232270676803L; TC: ±100ppm/°C; PressFit: No; Part Number: R0402_68K_1%_0.0625W_100PPM; Component Kind: Standard; Component Type: Standard; Pin Count: 2; Value: 68k; Status: Not Recommended; Power: 0.0625W; Manufacturer Part Number: R0402_68K_1%_0.0625W_100PPM; Case: 0402; Mounted: Yes; Sense: No; Socket: No; SMD: Yes; Manufacturer1 Example: YAGEO PHYCOMP; Manufacturer1 ComponentHeight: 0.4mm; HelpURL: \\cern.ch\dfs\Applications\Altium\Datasheets\R0402_Phycomp_RC0402.pdf; Author: CERN DEM JLC; CreateDate: 03.12.2007; LatestRevisionDate: 17.10.2012
R89 = R0402_10K_1%_0.0625W_100PPM: Resistor - 1%; Part Description: General Purpose Thick Film Chip Resistor; Manufacturer: GENERIC; Manufacturer1 Part Number: 232270671003L; TC: ±100ppm/°C; PressFit: No; Part Number: R0402_10K_1%_0.0625W_100PPM; Component Kind: Standard; Component Type: Standard; Pin Count: 2; Value: 10k; Status: Not Recommended; Power: 0.0625W; Manufacturer Part Number: R0402_10K_1%_0.0625W_100PPM; Case: 0402; Mounted: Yes; Sense: No; Socket: No; SMD: Yes; Manufacturer1 Example: YAGEO PHYCOMP; Manufacturer1 ComponentHeight: 0.4mm; HelpURL: \\cern.ch\dfs\Applications\Altium\Datasheets\R0402_Phycomp_RC0402.pdf; Author: CERN DEM JLC; CreateDate: 12/3/2007; LatestRevisionDate: 10/17/2012